# Altium schematic sheet PiArcadeGPIO.SchDoc
size A
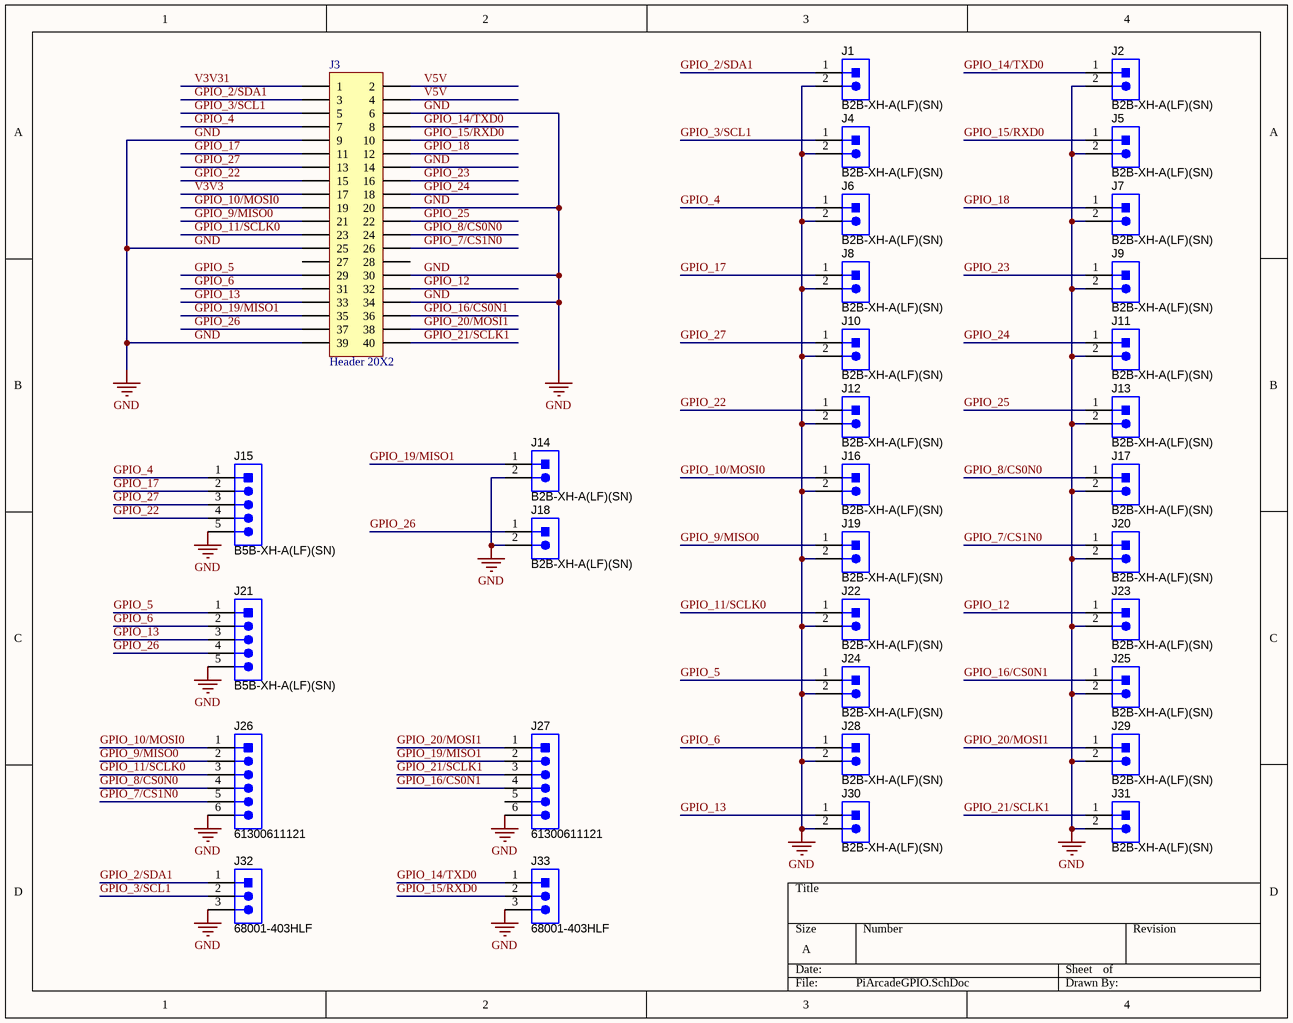
[diagram p0: PiArcadeGPIO.SchDoc]

## Parts
J1  B2B-XH-A(LF)(SN)  [JST_B2B-XH-A]
J2  B2B-XH-A(LF)(SN)  [JST_B2B-XH-A]
J3  Header 20X2  [HDR2X20]
J4  B2B-XH-A(LF)(SN)  [JST_B2B-XH-A]
J5  B2B-XH-A(LF)(SN)  [JST_B2B-XH-A]
J6  B2B-XH-A(LF)(SN)  [JST_B2B-XH-A]
J7  B2B-XH-A(LF)(SN)  [JST_B2B-XH-A]
J8  B2B-XH-A(LF)(SN)  [JST_B2B-XH-A]
J9  B2B-XH-A(LF)(SN)  [JST_B2B-XH-A]
J10  B2B-XH-A(LF)(SN)  [JST_B2B-XH-A]
J11  B2B-XH-A(LF)(SN)  [JST_B2B-XH-A]
J12  B2B-XH-A(LF)(SN)  [JST_B2B-XH-A]
J13  B2B-XH-A(LF)(SN)  [JST_B2B-XH-A]
J14  B2B-XH-A(LF)(SN)  [JST_B2B-XH-A]
J15  B5B-XH-A(LF)(SN)  [JST_B5B-XH-A]
J16  B2B-XH-A(LF)(SN)  [JST_B2B-XH-A]
J17  B2B-XH-A(LF)(SN)  [JST_B2B-XH-A]
J18  B2B-XH-A(LF)(SN)  [JST_B2B-XH-A]
J19  B2B-XH-A(LF)(SN)  [JST_B2B-XH-A]
J20  B2B-XH-A(LF)(SN)  [JST_B2B-XH-A]
J21  B5B-XH-A(LF)(SN)  [JST_B5B-XH-A]
J22  B2B-XH-A(LF)(SN)  [JST_B2B-XH-A]
J23  B2B-XH-A(LF)(SN)  [JST_B2B-XH-A]
J24  B2B-XH-A(LF)(SN)  [JST_B2B-XH-A]
J25  B2B-XH-A(LF)(SN)  [JST_B2B-XH-A]
J26  61300611121  [WURTH_61300611121]
J27  61300611121  [WURTH_61300611121]
J28  B2B-XH-A(LF)(SN)  [JST_B2B-XH-A]
J29  B2B-XH-A(LF)(SN)  [JST_B2B-XH-A]
J30  B2B-XH-A(LF)(SN)  [JST_B2B-XH-A]
J31  B2B-XH-A(LF)(SN)  [JST_B2B-XH-A]
J32  68001-403HLF  [FCI_68001-403HLF]
J33  68001-403HLF  [FCI_68001-403HLF]

## Nets
GND: J1.2 J2.2 J3.6 J3.9 J3.14 J3.20 J3.25 J3.30 J3.34 J3.39 J4.2 J5.2 J6.2 J7.2 J8.2 J9.2 J10.2 J11.2 J12.2 J13.2 J14.2 J15.5 J16.2 J17.2 J18.2 J19.2 J20.2 J21.5 J22.2 J23.2 J24.2 J25.2 J26.6 J27.6 J28.2 J29.2 J30.2 J31.2 J32.3 J33.3
GPIO_2/SDA1: J1.1 J3.3 J32.1
GPIO_3/SCL1: J3.5 J4.1 J32.2
GPIO_4: J3.7 J6.1 J15.1
GPIO_5: J3.29 J21.1 J24.1
GPIO_6: J3.31 J21.2 J28.1
GPIO_7/CS1N0: J3.26 J20.1 J26.5
GPIO_8/CS0N0: J3.24 J17.1 J26.4
GPIO_9/MISO0: J3.21 J19.1 J26.2
GPIO_10/MOSI0: J3.19 J16.1 J26.1
GPIO_11/SCLK0: J3.23 J22.1 J26.3
GPIO_12: J3.32 J23.1
GPIO_13: J3.33 J21.3 J30.1
GPIO_14/TXD0: J2.1 J3.8 J33.1
GPIO_15/RXD0: J3.10 J5.1 J33.2
GPIO_16/CS0N1: J3.36 J25.1 J27.4
GPIO_17: J3.11 J8.1 J15.2
GPIO_18: J3.12 J7.1
GPIO_19/MISO1: J3.35 J14.1 J27.2
GPIO_20/MOSI1: J3.38 J27.1 J29.1
GPIO_21/SCLK1: J3.40 J27.3 J31.1
GPIO_22: J3.15 J12.1 J15.4
GPIO_23: J3.16 J9.1
GPIO_24: J3.18 J11.1
GPIO_25: J3.22 J13.1
GPIO_26: J3.37 J18.1 J21.4
GPIO_27: J3.13 J10.1 J15.3
V3V3: J3.17
V3V31: J3.1
V5V: J3.2 J3.4

Not connected (* = marked no-connect by the designer): J3 27 28; J27 5

## Library data of the parts
J1 J2 J4-J14 J16-J20 J22-J25 J28-J31 = B2B-XH-A(LF)(SN): Header (Shrouded), 2.5mm, 2x1, Tin, TH; Manufacturer: JST Manufacturing; SymbolCreator: a0412235; Pitch_mm: 2.5; Gender: Male; Shrouded: Y; Row_Count: 1; Current_A: 3; Voltage_V: 250; SymbolVersion: 2013-10-31; PartNumber: B2B-XH-A(LF)(SN); PackageReference: Header (Shrouded), 2.5mm, 2x1, TH; CompType: Header; RoHS: Y; MountType: TH; ComponentLink1Description: Datasheet URL; ComponentLink1URL: http://www.jst-mfg.com/product/pdf/eng/eXH.pdf; Orientation: Vertical; PinCount: 2; ContactFinish: Tin; Color: White; Cert_CSA: Y; Cert_UL: Y; Publisher: Texas Instruments; LatestRevisionDate: 2016-11-04; Supplier 1: Digi-Key; Supplier Part Number 1: 455-2247-ND
J3 = Header 20X2: Header, 20-Pin, Dual row; LatestRevisionDate: 17-Jul-2002; LatestRevisionNote: Re-released for DXP Platform.; Publisher: Altium Limited
J15 J21 = B5B-XH-A(LF)(SN): Header(shrouded), 2.5mm, 5x1, Tin, TH; Manufacturer: JST Manufacturing; SymbolCreator: a0412235; Pitch_mm: 2.5; Gender: Male; Shrouded: Y; Row_Count: 1; Current_A: 3; Voltage_V: 250; SymbolVersion: 2013-12-22; PartNumber: B5B-XH-A(LF)(SN); PackageReference: Header(shrouded), 2.5mm, 5x1, TH; CompType: Header; RoHS: Y; MountType: TH; ComponentLink1Description: Datasheet URL; ComponentLink1URL: http://www.jst-mfg.com/product/pdf/eng/eXH.pdf; Orientation: Vertical; PinCount: 5; ContactFinish: Tin; Color: White; Cert_CSA: Y; Cert_UL: Y; Publisher: Texas Instruments; LatestRevisionDate: 2016-11-04; Supplier 1: Digi-Key; Supplier Part Number 1: 455-2270-ND
J26 J27 = 61300611121: Header, 2.54 mm, 6x1, Gold, TH; Manufacturer: Wurth Elektronik; SymbolCreator: a0412235; SymbolVersion: 2013-08-30; PartNumber: 61300611121; PackageReference: Header, 2.54mm, 6x1, TH; ClassName: Header; CompType: Header; RoHS: Y; MountType: TH; ComponentLink1Description: Datasheet URL; ComponentLink1URL: http://katalog.we-online.de/em/datasheet/6130xx11121.pdf; Publisher: Texas Instruments; LatestRevisionDate: 2016-11-04; Supplier 1: Digi-Key; Supplier Part Number 1: 732-5319-ND; Supplier 2: Mouser; Supplier Part Number 2: 710-61300611121; Supplier 3: Farnell; Supplier Part Number 3: 2356158
J32 J33 = 68001-403HLF: Header, 2.54mm, 3x1, Tin, TH; Manufacturer: FCI; SymbolCreator: a0799628; Pitch_mm: 2.54; Gender: Male; Shrouded: N; Row_Count: 1; Current_A: 3; Voltage_V: 1500; Cert_CSA: Y; SymbolVersion: 2013-03-28; PartNumber: 68001-403HLF; PackageReference: Header, 2.54mm, 3x1, TH; ClassName: Header; CompType: Header; RoHS: Y; MountType: TH; ComponentLink1Description: Datasheet URL; ComponentLink1URL: http://portal.fciconnect.com/Comergent//fci/drawing/68000.pdf; Orientation: Vertical; PinCount: 3; ContactFinish: Tin; Color: Black; Cert_UL: Y; Publisher: Texas Instruments; LatestRevisionDate: 2016-11-04; Supplier 1: Digi-Key; Supplier Part Number 1: 609-3471-ND; Supplier 2: Mouser; Supplier Part Number 2: 649-68001-403HLF; Supplier 3: Farnell; Supplier Part Number 3: 1835553